# EAGLE design lightplayslider (EAGLE 7.2.0)
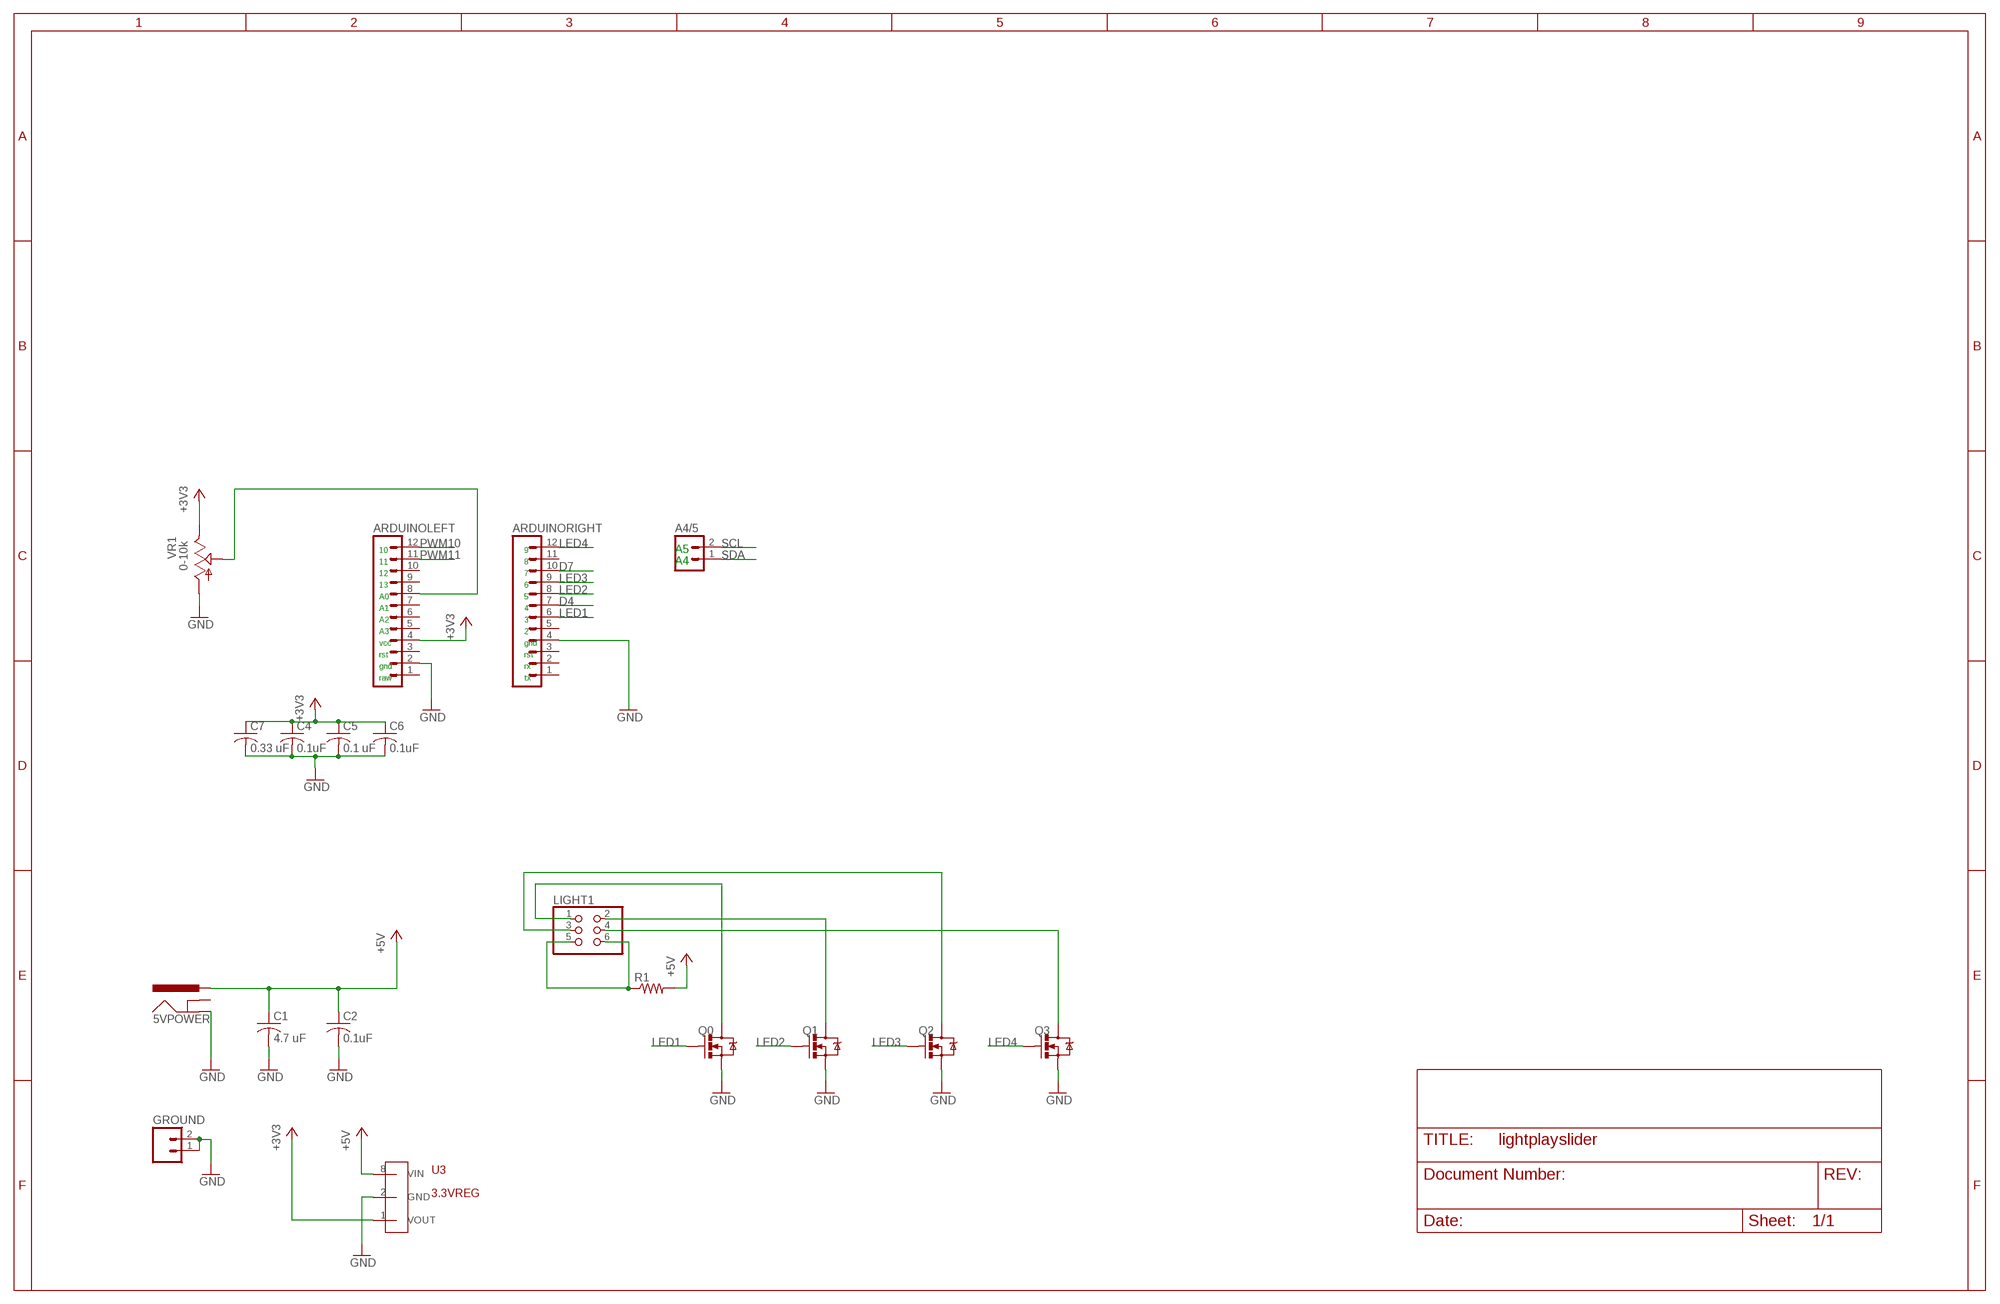
[diagram p0: schematic, sheet 1]

## Parts
5VPOWER  POWER_JACKPTH  [POWER_JACK_PTH]
A4/5  M02PTH  [1X02]
ARDUINOLEFT  M12PTH  [1X12]
ARDUINORIGHT  M12PTH  [1X12]
C1  4.7 uF  C-USC1206  [C1206]
C2  0.1uF  C-USC0805  [C0805]
C4  0.1uF  C-USC0805  [C0805]
C5  0.1 uF  C-USC0805  [C0805]
C6  0.1uF  C-USC0805  [C0805]
C7  0.33 uF  C-USC1206  [C1206]
GROUND  M02PTH  [1X02]
LIGHT1  PINHD-2X3  [2X03]
Q0  MOSFET-NCHANNELAO3404A  [SOT23-3]
Q1  MOSFET-NCHANNELAO3404A  [SOT23-3]
Q2  MOSFET-NCHANNELAO3404A  [SOT23-3]
Q3  MOSFET-NCHANNELAO3404A  [SOT23-3]
R1  R-US_0617/17  [0617/17]
U3  3.3VREG  STM3.3VREG  [SO08]
VR1  0-10k  SLIDER30MM  [SLIDER-MEDIUM]

## Nets
+3V3: ARDUINOLEFT.4 C4.1 C5.1 C6.1 C7.1 U3.1(VOUT) VR1.TOP(E)
+5V [power]: 5VPOWER.PWR C1.1 C2.1 R1.2 U3.8(VIN)
D4: ARDUINORIGHT.7
D7: ARDUINORIGHT.10
GND [power]: 5VPOWER.GND ARDUINOLEFT.2 ARDUINORIGHT.4 C1.2 C2.2 C4.2 C5.2 C6.2 C7.2 GROUND.1 GROUND.2 Q0.2(S) Q1.2(S) Q2.2(S) Q3.2(S) U3.2(GND) VR1.BOTTOM(A)
LED1: ARDUINORIGHT.6 Q0.1(G)
LED2: ARDUINORIGHT.8 Q1.1(G)
LED3: ARDUINORIGHT.9 Q2.1(G)
LED4: ARDUINORIGHT.12 Q3.1(G)
N$1: ARDUINOLEFT.8 VR1.WIPER(S)
N$5 [power]: LIGHT1.5 LIGHT1.6 R1.1
N$8 [power]: LIGHT1.1 Q0.3(D)
N$10 [power]: LIGHT1.2 Q1.3(D)
N$14 [power]: LIGHT1.3 Q2.3(D)
N$15 [power]: LIGHT1.4 Q3.3(D)
PWM10: ARDUINOLEFT.12
PWM11: ARDUINOLEFT.11
SCL: A4/5.2
SDA: A4/5.1
Unconnected: 5VPOWER.GNDBREAK ARDUINOLEFT.1 ARDUINOLEFT.3 ARDUINOLEFT.5 ARDUINOLEFT.6 ARDUINOLEFT.7 ARDUINOLEFT.9 ARDUINOLEFT.10 ARDUINORIGHT.1 ARDUINORIGHT.2 ARDUINORIGHT.3 ARDUINORIGHT.5 ARDUINORIGHT.11

## Notes on the sheet
- 10 | 9 | A5
- 11 | 8 | A4
- 12 | 7
- 13 | 6
- A0 | 5
- A1 | 4
- A2 | 3
- A3 | 2
- vcc | gnd
- rst | rst
- gnd | rx
- raw | tx

## Library data of the parts
5VPOWER = SparkFun-Connectors:POWER_JACK: Power Jack This is the standard 5.5mm barrel jack for power. The PTH is the most common, proven, reliable, footprint. The Slot footprint only works if the mill layer is transmitted to the PCB fab house so be warned. Mating wall wart : TOL-00298 (and others); PROD_ID: CONN-08197
A4/5 GROUND = SparkFun-Connectors:M02: Standard 2-pin 0.1" header. Use with - straight break away headers ( PRT-00116) - right angle break away headers (PRT-00553) - swiss pins (PRT-00743) - machine pins (PRT-00117) - female headers (PRT-00115) Molex polarized connector foot print use with: PRT-08233 with associated crimp pins and housings. 2.54_SCREWTERM for use with PRT-10571. 3.5mm Screw Terminal footprints for PRT-08084 5mm Screw Terminal footprints for use with PRT-08432
ARDUINOLEFT ARDUINORIGHT = SparkFun-Connectors:M12: Header 12 Standard 12-pin 0.1" header. Use with straight break away headers (SKU : PRT-00116), right angle break away headers (PRT-00553), swiss pins (PRT-00743), machine pins (PRT-00117), and female headers (PRT-00115).
C1 C2 C4-C7 = resistor:C-US: CAPACITOR, American symbol
LIGHT1 = SparkFun-Connectors:PINHD-2X3: PIN HEADER
Q0 Q1-Q3 = SparkFun-DiscreteSemi:MOSFET-NCHANNEL: Common NMOSFET Parts MFG P/N Store ID Prod ID FDD8780 TRANS-09984 SI7820DN TRANS-11055 FDS6630A IC-08089 2N7002PW TRANS-11151 FQP30N06L COM-10213 TRANS-10060 BSS123LT1G TRANS-08345 BSS138 TRANS-00830 BS170 2N7000; PROD_ID: TRAN-12988
R1 = robbie:R-US_: RESISTOR, American symbol
U3 = robbie:STM3.3VREG
VR1 = SparkFun-Electromechanical:SLIDER: Slide-type potentiometers. Small and meduim footprints untested.; PROD_ID: COM-11621

## Net classes
0 default: width 0.254 mm, clearance 0.203 mm
1 power: width 0.508 mm, clearance 0.254 mm

## Board
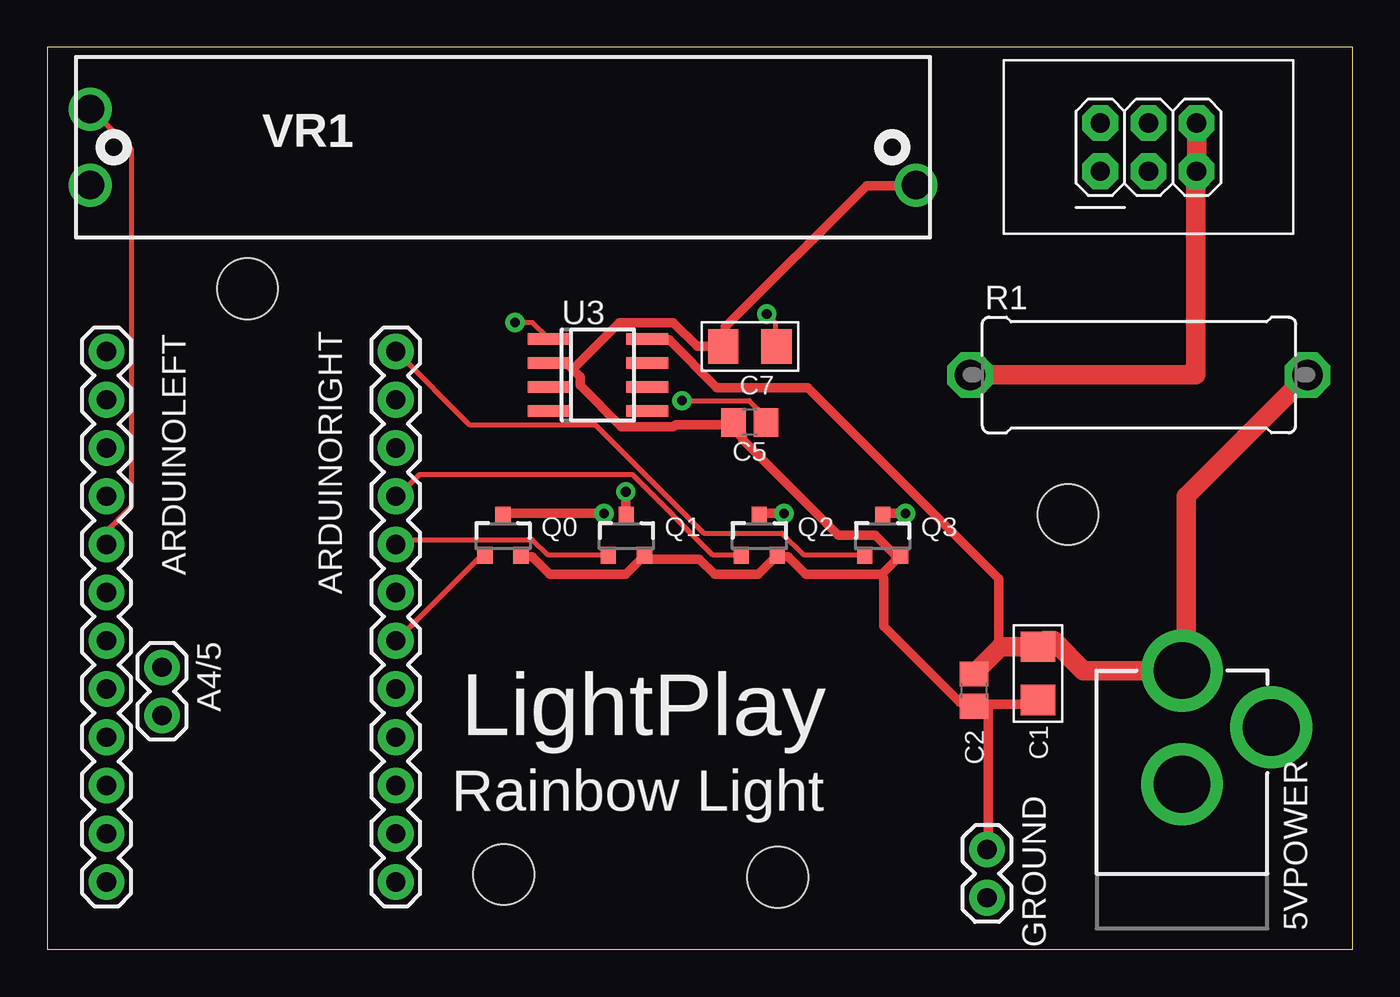
[diagram p1: board, top side]
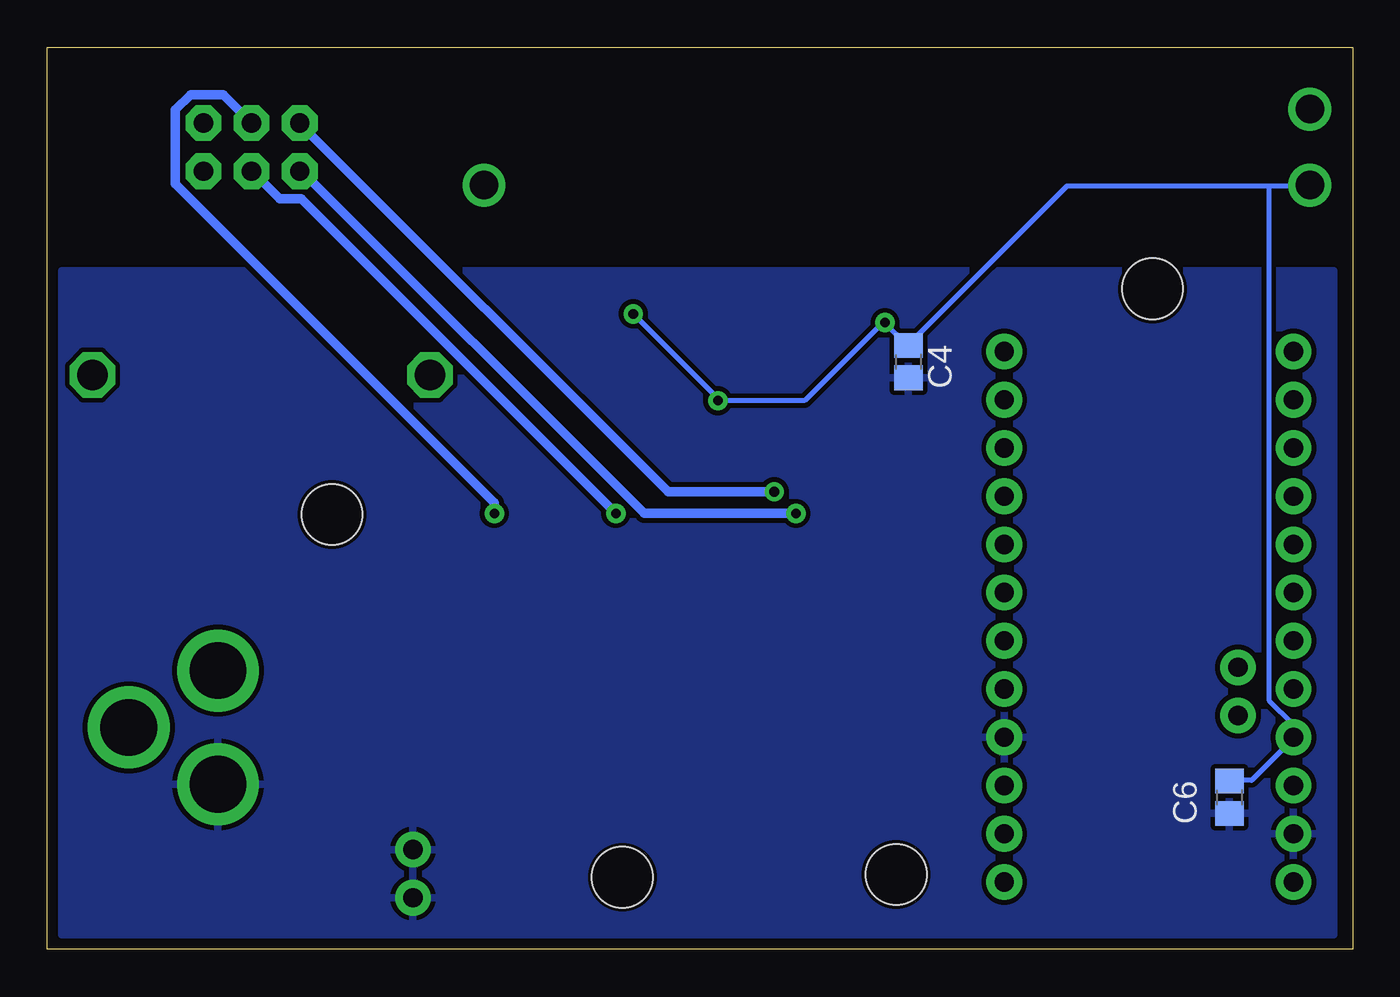
[diagram p2: board, bottom side, seen from below]

Size 68.75 x 47.51 mm. Coordinates in mm from the lower left corner, seen from the top.
Outline: 0,0 68.75,0 68.75,47.51 0,47.51 0,0
Copper layers (1*16): Top 0.035mm / dielectric 1.5mm / Bottom 0.035mm
Design rules "SparkFun": minimum track width 8mil, minimum drill 20mil, track to track 8mil, track to pad 8mil, pad to pad 8mil, via to via 8mil, smd to smd 8mil, copper to edge 8mil, drill to drill 8mil, minimum pad ring 12mil, minimum via ring 10mil, stop-mask expansion 4mil, vias tented up to drill 20mil, thermal gap 10mil
Holes 3.2 mm at 10.54,34.79 24.04,3.94 38.47,3.79 53.77,22.9

### Footprints (pad centres in the part's own frame; a part is rotated, then mirrored left to right if it is on the bottom)
POWER_JACK_PTH = drill 2.997 pad 4.318: GND 0,7.7; GNDBREAK 4.7,10.7; PWR 0,13.7
1X02 = drill 1.016 pad 1.88: 1 0,0; 2 2.54,0
1X12 = drill 1.016 pad 1.88: 1 0,0; 2 2.54,0; 3 5.08,0; 4 7.62,0; 5 10.16,0; 6 12.7,0; 7 15.24,0; 8 17.78,0; 9 20.32,0; 10 22.86,0; 11 25.4,0; 12 27.94,0
C1206 = smd 1.6 x 1.8: 1 -1.4,0; 2 1.4,0
C0805 = smd 1.3 x 1.5: 1 -0.85,0; 2 0.85,0
2X03 = drill 1.016 pad 1.88 octagon: 1 -2.54,-1.27; 2 -2.54,1.27; 3 0,-1.27; 4 0,1.27; 5 2.54,-1.27; 6 2.54,1.27
SOT23-3 = smd 0.8 x 0.9: 1 -0.95,-1; 2 0.95,-1; 3 0,1.1
0617/17 = drill 1.6 octagon: 1 -8.89,0; 2 8.89,0
SO08 = smd 0.6 x 2.2: 1 -1.905,-2.6; 2 -0.635,-2.6; 3 0.635,-2.6; 4 1.905,-2.6; 5 1.905,2.6; 6 0.635,2.6; 7 -0.635,2.6; 8 -1.905,2.6
SLIDER-MEDIUM = drill 1.5: BOTTOM 21.75,-2; TOP -21.75,-2; WIPER -21.75,2

### Placement (x,y rotation side)
5VPOWER  59.77,0.98 0 top
A4/5  6.03,14.85 270 top
ARDUINOLEFT  3.11,3.55 90 top
ARDUINORIGHT  18.35,3.55 90 top
C1  52.18,14.53 270 top
C2  48.8,13.65 270 top
C4  23.4,30.95 270 bottom
C5  37,27.75 180 top
C6  6.49,8.01 270 bottom
C7  37,31.75 180 top
GROUND  49.5,5.25 270 top
LIGHT1  58,42.25 0 top
Q0  24,21.75 0 top
Q1  30.5,21.75 0 top
Q2  37.5,21.75 0 top
Q3  44,21.75 0 top
R1  57.5,30.25 0 top
U3  29,30.25 270 top
VR1  24,42.25 0 top

### Tracks (layer width: path | path; a pad name or v marks a point on that pad's centre or on a via)
+3V3  (via drill 0.51)
  Top 0.254: v24.63,33.02 25.55,33.02 26.35,32.21 U3.1 | v33.43,28.9 36.98,28.9 37.78,28.1 37.78,27.76 C5.1 | v37.89,33.47 38.35,33.02 38.35,31.76 C7.1
  Bottom 0.254: C6.1 6.46,8.9 5.32,8.9 3.14,11.07 ARDUINOLEFT.4 3.14,11.18 3.14,11.87 4.4,13.13 4.4,40.22 | v37.89,33.47 33.43,29.02 v33.43,28.9 28.86,28.9 24.75,33.02 v24.63,33.02 23.49,31.87 C4.1 23.38,31.87 15.03,40.22 4.4,40.22 | 4.4,40.22 2.34,40.22 VR1.TOP
+5V
  Top 0.508: U3.8 31.6,32.1 32.75,32.1 35.26,29.59 40.06,29.59 50.12,19.53 50.12,16.44 50.23,15.93
  Top 1.016: R1.2 60,23.86 60,14.68 5VPOWER.PWR 54.57,14.68 53,16.25 52.5,16.25 C1.1 50.23,15.93 C2.1
GND
  Top 0.508: 27.66,30.56 27.38,30.84 26.46,30.84 U3.2 | 27.66,30.56 28.06,30.16 28.06,29.7 30.23,27.53 32.98,27.53 33.09,27.64 36.06,27.64 C5.2 36.18,27.42 36.63,26.96 36.63,26.84 41.66,21.81 43.61,21.81 44.63,20.79 Q3.2 44.86,20.67 43.95,19.76 | 27.66,30.56 30.12,33.02 32.98,33.02 34.23,31.76 35.49,31.76 C7.2 35.72,31.99 35.72,32.79 43.15,40.22 45.66,40.22 VR1.BOTTOM | C2.2 48.86,12.9 51.95,12.9 C1.2 | C2.2 49.55,12.67 49.55,5.36 GROUND.1 | Q0.2 24.98,20.67 25.55,20.67 26.46,19.76 30.46,19.76 31.38,20.67 Q1.2 31.6,20.56 34.35,20.56 35.15,19.76 37.43,19.76 38.23,20.56 Q2.2 38.46,20.67 39.03,20.67 39.95,19.76 43.95,19.76 | C2.2 48.63,13.01 48.06,13.01 44.06,17.01 44.06,19.53 43.95,19.76
  pour Bottom: 1,35.75 68,35.75 68,0.75 1,0.75
LED1
  Top 0.254: Q0.1 23.03,20.67 22.8,20.67 18.46,16.33 ARDUINORIGHT.6
LED2
  Top 0.254: Q1.1 29.55,20.79 26.35,20.79 25.55,21.59 18.69,21.59 18.46,21.36 ARDUINORIGHT.8
LED3
  Top 0.254: Q2.1 36.52,20.79 35.03,20.79 30.8,25.01 19.6,25.01 18.46,23.87 ARDUINORIGHT.9
LED4
  Top 0.254: Q3.1 43.03,20.79 39.83,20.79 38.69,21.93 34.58,21.93 28.86,27.64 22.23,27.64 18.46,31.42 ARDUINORIGHT.12
N$1
  Top 0.254: ARDUINOLEFT.8 3.14,21.36 3.14,22.04 4.4,23.3 4.4,42.16 2.34,44.22 VR1.WIPER
N$5
  Top 1.016: LIGHT1.6 LIGHT1.5 60.5,40.98 60.5,30.25 R1.1
N$8  (via drill 0.51)
  Top 0.508: v29.32,22.96 24.06,22.96 Q0.3
  Bottom 0.508: v29.32,22.96 37.32,22.96 55.38,41.02 LIGHT1.1
N$10  (via drill 0.51)
  Top 0.508: v30.46,24.1 30.46,22.96 Q1.3
  Bottom 0.508: v30.46,24.1 36.06,24.1 55.38,43.42 LIGHT1.2
N$14  (via drill 0.51)
  Top 0.508: v38.81,22.96 37.55,22.96 Q2.3
  Bottom 0.508: v38.81,22.96 55.38,39.53 56.52,39.53 57.89,40.9 LIGHT1.3
N$15  (via drill 0.51)
  Top 0.508: v45.21,22.96 44.06,22.96 Q3.3
  Bottom 0.508: v45.21,22.96 45.21,23.53 62.01,40.33 62.01,44.22 61.21,45.02 59.49,45.02 LIGHT1.4

### Text on the board
tPlace: LightPlay | Rainbow Light